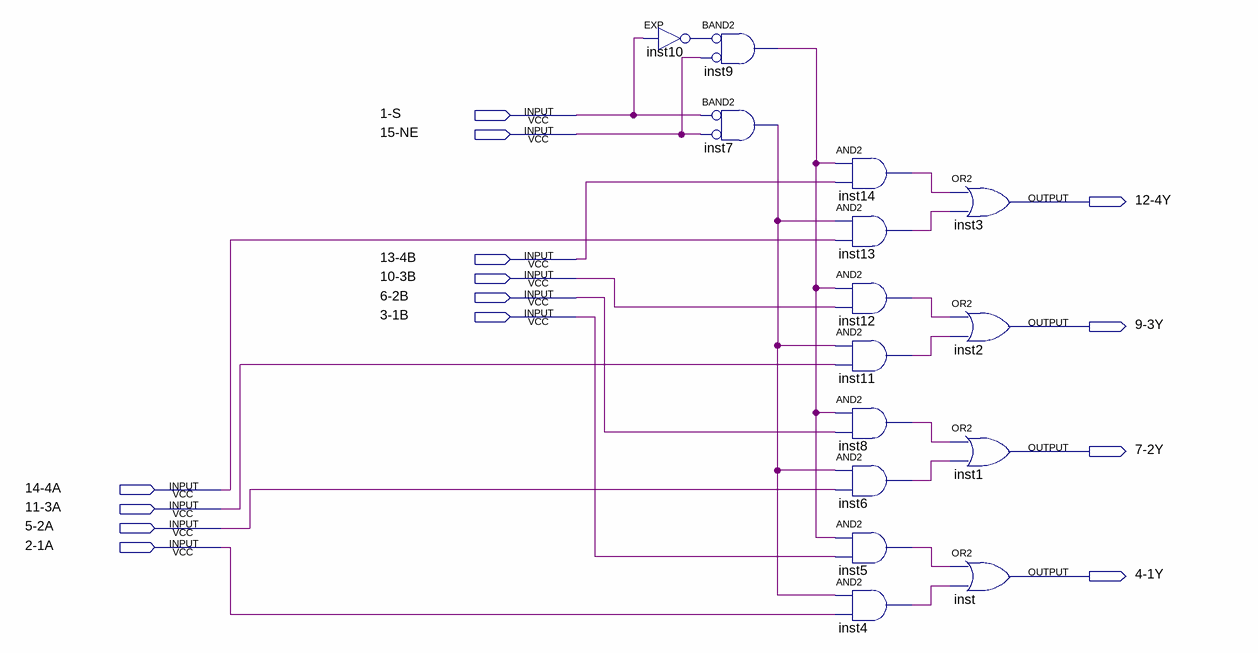
[diagram p0: schematic sheet]
// Quartus schematic 74LS157.bdf as structural Verilog: 15 symbols, 14 pins
module \74LS157  (
  input  \1-S ,
  input  \15-NE ,
  input  \13-4B ,
  input  \10-3B ,
  input  \6-2B ,
  input  \3-1B ,
  input  \14-4A ,
  input  \11-3A ,
  input  \5-2A ,
  input  \2-1A ,
  output \12-4Y ,
  output \9-3Y ,
  output \7-2Y ,
  output \4-1Y 
);

  wire inst4_out, inst5_out, inst6_out, inst7_out, inst8_out, inst9_out, inst10_out, inst11_out, inst12_out,
       inst13_out, inst14_out;

  EXP inst10 (.IN(\1-S ), .OUT(inst10_out));
  and inst9 (inst9_out, ~inst10_out, ~\15-NE );  // BAND2
  and inst7 (inst7_out, ~\1-S , ~\15-NE );  // BAND2
  and inst14 (inst14_out, inst9_out, \13-4B );
  and inst13 (inst13_out, inst7_out, \14-4A );
  and inst12 (inst12_out, inst9_out, \10-3B );
  and inst11 (inst11_out, inst7_out, \11-3A );
  and inst8 (inst8_out, inst9_out, \6-2B );
  and inst6 (inst6_out, inst7_out, \5-2A );
  and inst5 (inst5_out, inst9_out, \3-1B );
  and inst4 (inst4_out, inst7_out, \2-1A );
  or inst3 (\12-4Y , inst14_out, inst13_out);
  or inst2 (\9-3Y , inst12_out, inst11_out);
  or inst1 (\7-2Y , inst8_out, inst6_out);
  or inst (\4-1Y , inst5_out, inst4_out);
endmodule
